# EAGLE design Resistor Board (EAGLE 9.6.2)
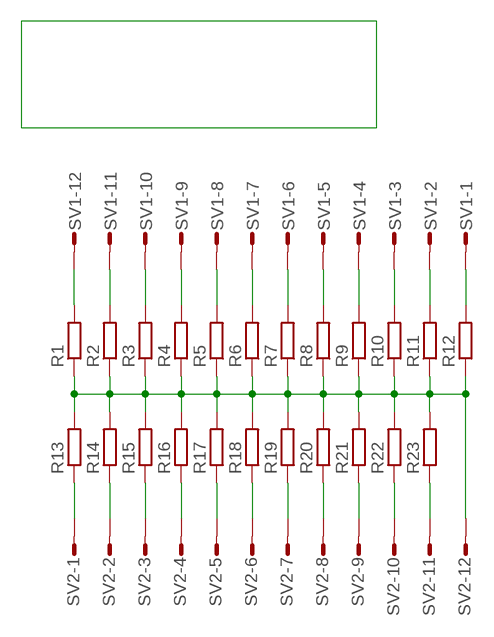
[diagram p0: schematic, sheet 1]

## Parts
R1  R-EU_0207/10  [0207/10]
R2  R-EU_0207/10  [0207/10]
R3  R-EU_0207/10  [0207/10]
R4  R-EU_0207/10  [0207/10]
R5  R-EU_0207/10  [0207/10]
R6  R-EU_0207/10  [0207/10]
R7  R-EU_0207/10  [0207/10]
R8  R-EU_0207/10  [0207/10]
R9  R-EU_0207/10  [0207/10]
R10  R-EU_0207/10  [0207/10]
R11  R-EU_0207/10  [0207/10]
R12  R-EU_0207/10  [0207/10]
R13  R-EU_0207/10  [0207/10]
R14  R-EU_0207/10  [0207/10]
R15  R-EU_0207/10  [0207/10]
R16  R-EU_0207/10  [0207/10]
R17  R-EU_0207/10  [0207/10]
R18  R-EU_0207/10  [0207/10]
R19  R-EU_0207/10  [0207/10]
R20  R-EU_0207/10  [0207/10]
R21  R-EU_0207/10  [0207/10]
R22  R-EU_0207/10  [0207/10]
R23  R-EU_0207/10  [0207/10]
SV1  S12P  [S12P]
SV2  S12P  [S12P]

## Nets
N$1: R13.1 SV2.1
N$2: R14.1 SV2.2
N$3: R15.1 SV2.3
N$4: R16.1 SV2.4
N$5: R17.1 SV2.5
N$6: R18.1 SV2.6
N$7: R19.1 SV2.7
N$8: R20.1 SV2.8
N$9: R21.1 SV2.9
N$10: R22.1 SV2.10
N$11: R23.1 SV2.11
N$12: R1.2 SV1.12
N$13: R1.1 R2.1 R3.1 R4.1 R5.1 R6.1 R7.1 R8.1 R9.1 R10.1 R11.1 R12.1 R13.2 R14.2 R15.2 R16.2 R17.2 R18.2 R19.2 R20.2 R21.2 R22.2 R23.2 SV2.12
N$14: R2.2 SV1.11
N$15: R3.2 SV1.10
N$16: R4.2 SV1.9
N$17: R5.2 SV1.8
N$18: R6.2 SV1.7
N$19: R7.2 SV1.6
N$20: R8.2 SV1.5
N$21: R9.2 SV1.4
N$22: R10.2 SV1.3
N$23: R11.2 SV1.2
N$24: R12.2 SV1.1

## Library data of the parts
R1-R23 = rcl:R-EU_: RESISTOR, European symbol; SPICEPREFIX: R
SV1 SV2 = con-amp-mt:S12P: AMP MT CONNECTOR; OC_FARNELL: unknown; OC_NEWARK: unknown

## Board
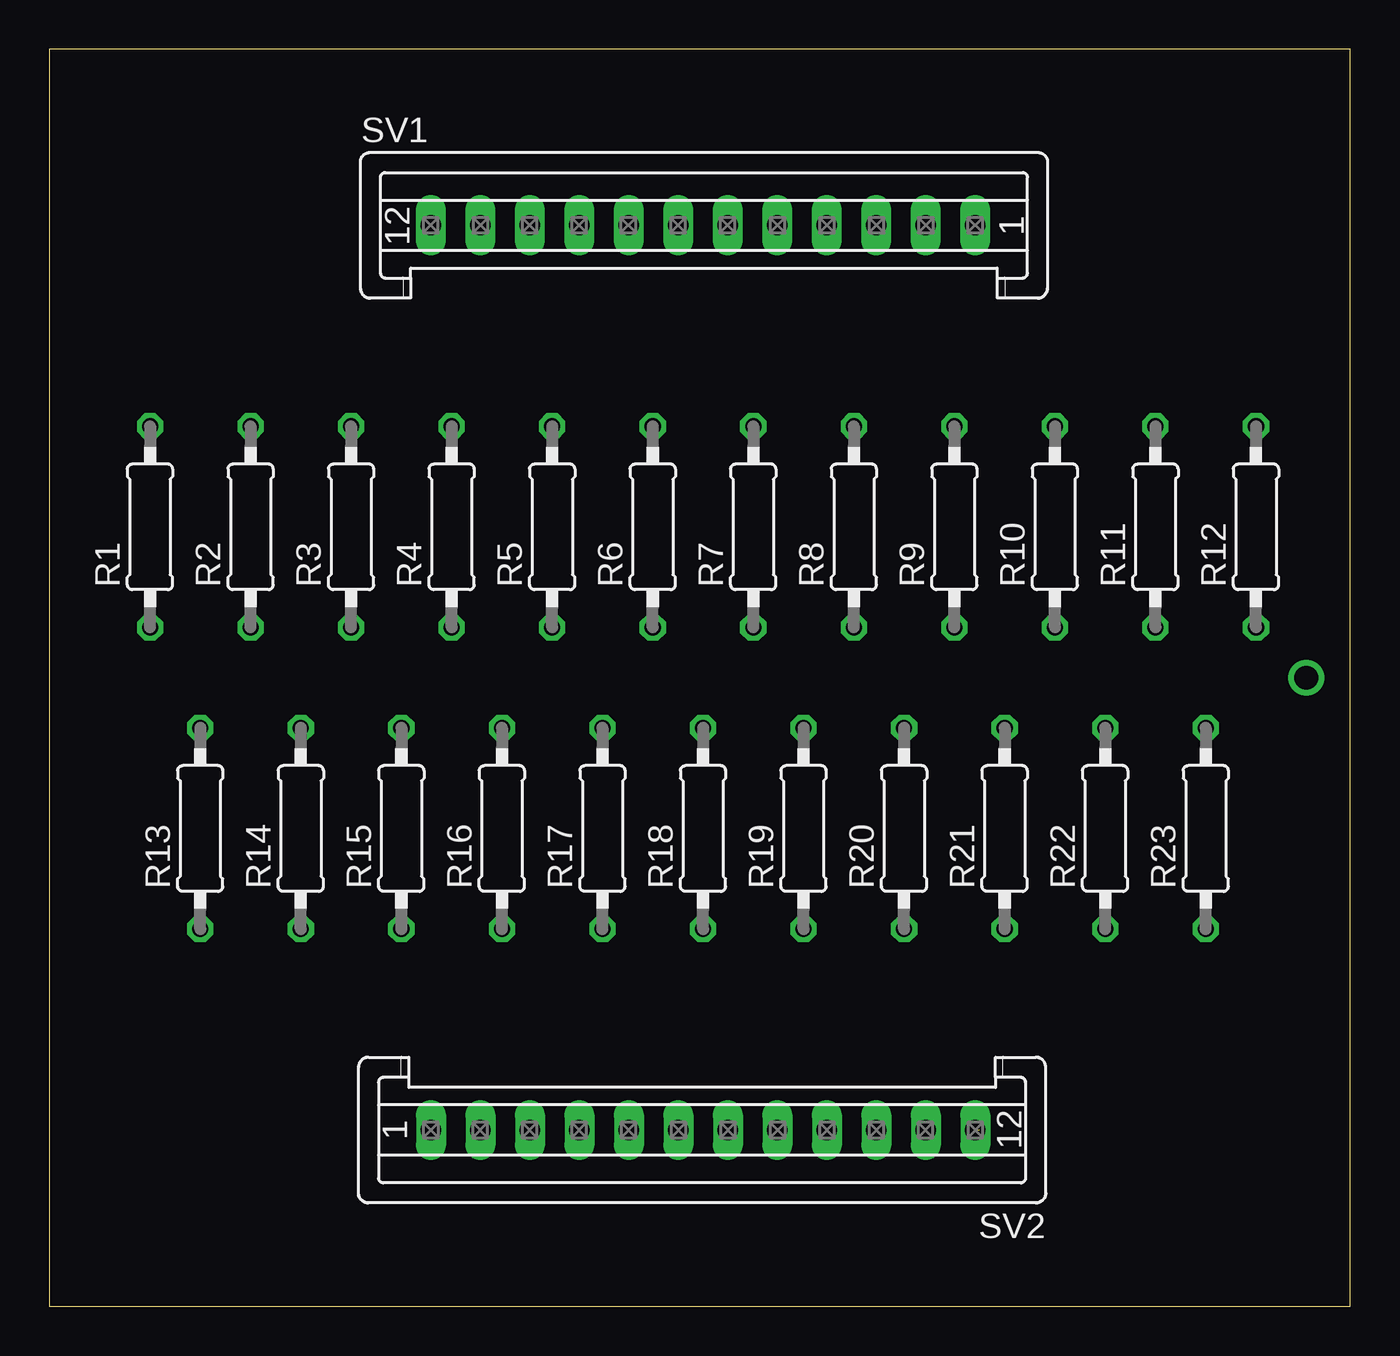
[diagram p1: board, top side]
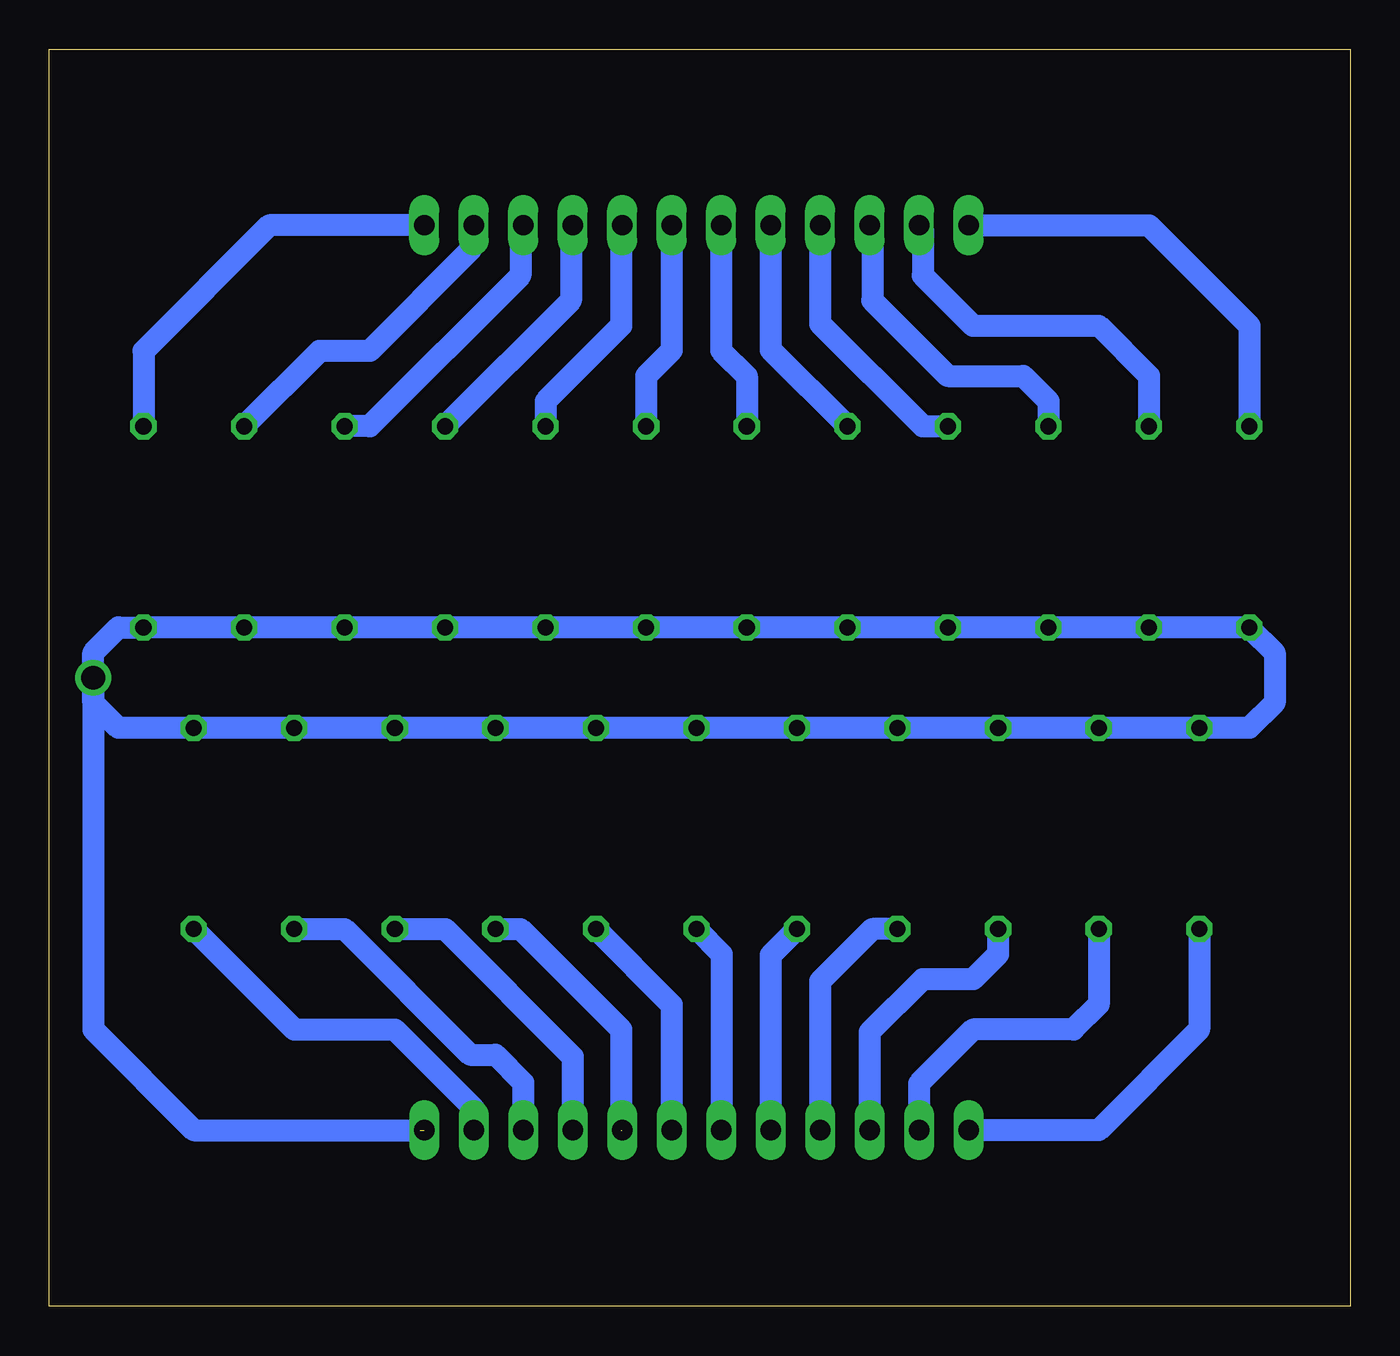
[diagram p2: board, bottom side, seen from below]

Size 65.71 x 63.49 mm. Coordinates in mm from the lower left corner, seen from the top.
Outline: 0,0 65.71,0 65.71,63.49 0,63.49 0,0
Copper layers (1*16): Top 0.035mm / dielectric 1.5mm / Bottom 0.035mm
Design rules "default": minimum track width 6mil, minimum drill 0.35mm, track to track 6mil, track to pad 6mil, pad to pad 6mil, via to via 6mil, smd to smd 6mil, copper to edge 40mil, drill to drill 6mil, minimum pad ring 10mil, minimum via ring 8mil, stop-mask expansion 4mil, vias tented up to drill 0mil, thermal gap 10mil

### Footprints (pad centres in the part's own frame; a part is rotated, then mirrored left to right if it is on the bottom)
0207/10 = drill 0.813 octagon: 1 -5.08,0; 2 5.08,0
S12P = drill 1.016 long: 1 13.75,0; 2 11.25,0; 3 8.75,0; 4 6.25,0; 5 3.75,0; 6 1.25,0; 7 -1.25,0; 8 -3.75,0; 9 -6.25,0; 10 -8.75,0; 11 -11.25,0; 12 -13.75,0

### Placement (x,y rotation side)
R1  5.08,39.37 90 top
R2  10.16,39.37 90 top
R3  15.24,39.37 90 top
R4  20.32,39.37 90 top
R5  25.4,39.37 90 top
R6  30.48,39.37 90 top
R7  35.56,39.37 90 top
R8  40.64,39.37 90 top
R9  45.72,39.37 90 top
R10  50.8,39.37 90 top
R11  55.88,39.37 90 top
R12  60.96,39.37 90 top
R13  7.62,24.13 90 top
R14  12.7,24.13 90 top
R15  17.78,24.13 90 top
R16  22.86,24.13 90 top
R17  27.94,24.13 90 top
R18  33.02,24.13 90 top
R19  38.1,24.13 90 top
R20  43.18,24.13 90 top
R21  48.26,24.13 90 top
R22  53.34,24.13 90 top
R23  58.42,24.13 90 top
SV1  33.02,54.61 0 top
SV2  33.02,8.89 180 top

### Tracks (layer width: path | path; a pad name or v marks a point on that pad's centre or on a via)
N$1
  Bottom 1.1: R13.1 7.62,13.97 12.7,8.89 SV2.1
N$2
  Bottom 1.1: R14.1 12.7,15.24 13.97,13.97 19.05,13.97 21.77,11.25 SV2.2
N$3
  Bottom 1.1: R15.1 17.78,17.78 19.05,16.51 21.59,16.51 24.27,13.83 SV2.3
N$4
  Bottom 1.1: R16.1 24.13,19.05 26.77,16.41 SV2.4
N$5
  Bottom 1.1: R17.1 29.27,17.72 SV2.5
N$6
  Bottom 1.1: R18.1 31.75,17.78 31.75,15.24 31.75,8.91 SV2.6
N$7
  Bottom 1.1: SV2.7 34.27,15.22 R19.1
N$8  (1 unrouted)
  Bottom 1.1: R20.1 41.91,19.05 36.83,13.97 36.83,8.89
N$9
  Bottom 1.1: SV2.9 39.27,12.6 45.72,19.05 R21.1
N$10
  Bottom 1.1: 41.91,9.03 SV2.10 41.77,11.29 43.18,12.7 44.45,12.7 50.8,19.05 R22.1
N$11
  Bottom 1.1: R23.1 53.34,13.97 48.26,13.97 44.27,9.98 SV2.11
N$12
  Bottom 1.1: SV1.12 10.16,54.61 5.08,49.53 R1.2
N$13  (via drill 1.2)  (1 unrouted)
  Bottom 1.1: v63.5,31.75 63.5,30.48 62.23,29.21 R23.2 R22.2 R21.2 R20.2 R19.2 R18.2 R17.2 R16.2 R15.2 R14.2 R13.2 5.08,29.21 3.81,30.48 3.81,33.02 R1.1 R2.1 R3.1 R4.1 R5.1 R6.1 R7.1 R8.1 R9.1 R10.1 R11.1 R12.1 62.23,34.29 63.5,33.02 v63.5,31.75 | v63.5,31.75 63.5,13.97 58.42,8.89 46.99,8.89
N$14
  Bottom 1.1: SV1.11 21.59,54.43 21.59,52.07 19.05,49.53 12.7,49.53 10.16,46.99 R2.2
N$15
  Bottom 1.1: SV1.10 24.13,54.47 24.13,50.8 20.32,46.99 16.51,46.99 15.24,45.72 R3.2
N$16
  Bottom 1.1: SV1.9 26.77,49.63 21.59,44.45 R4.2
N$17
  Bottom 1.1: SV1.8 29.27,48.32 R5.2
N$18
  Bottom 1.1: SV1.7 31.77,48.28 30.48,46.99 R6.2
N$19
  Bottom 1.1: SV1.6 34.27,48.28 35.56,46.99 R7.2
N$20
  Bottom 1.1: SV1.5 36.83,54.55 36.83,49.53 40.64,45.72 R8.2
N$21
  Bottom 1.1: SV1.4 39.37,54.51 39.37,50.8 R9.2
N$22
  Bottom 1.1: SV1.3 41.91,54.47 41.91,52.07 49.53,44.45 R10.2
N$23
  Bottom 1.1: SV1.2 44.45,54.43 44.45,53.34 49.53,48.26 52.07,48.26 R11.2
N$24
  Bottom 1.1: SV1.1 54.61,54.61 60.96,48.26 R12.2